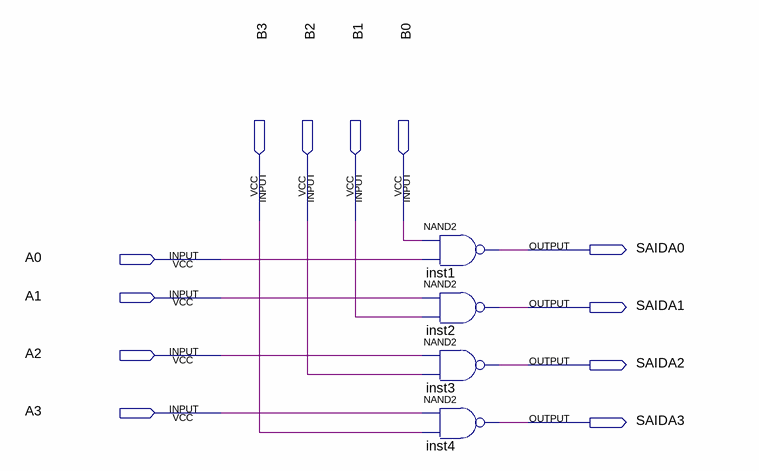
[diagram p0: schematic sheet]
// Quartus schematic nao_e.bdf as structural Verilog: 4 symbols, 12 pins
module nao_e (
  input  B3,
  input  B2,
  input  B1,
  input  B0,
  input  A0,
  input  A1,
  input  A2,
  input  A3,
  output SAIDA0,
  output SAIDA1,
  output SAIDA2,
  output SAIDA3
);

  nand inst1 (SAIDA0, B0, A0);
  nand inst2 (SAIDA1, A1, B1);
  nand inst3 (SAIDA2, A2, B2);
  nand inst4 (SAIDA3, A3, B3);
endmodule
